# EAGLE design LSF0204RGYR (EAGLE 7.5.0)
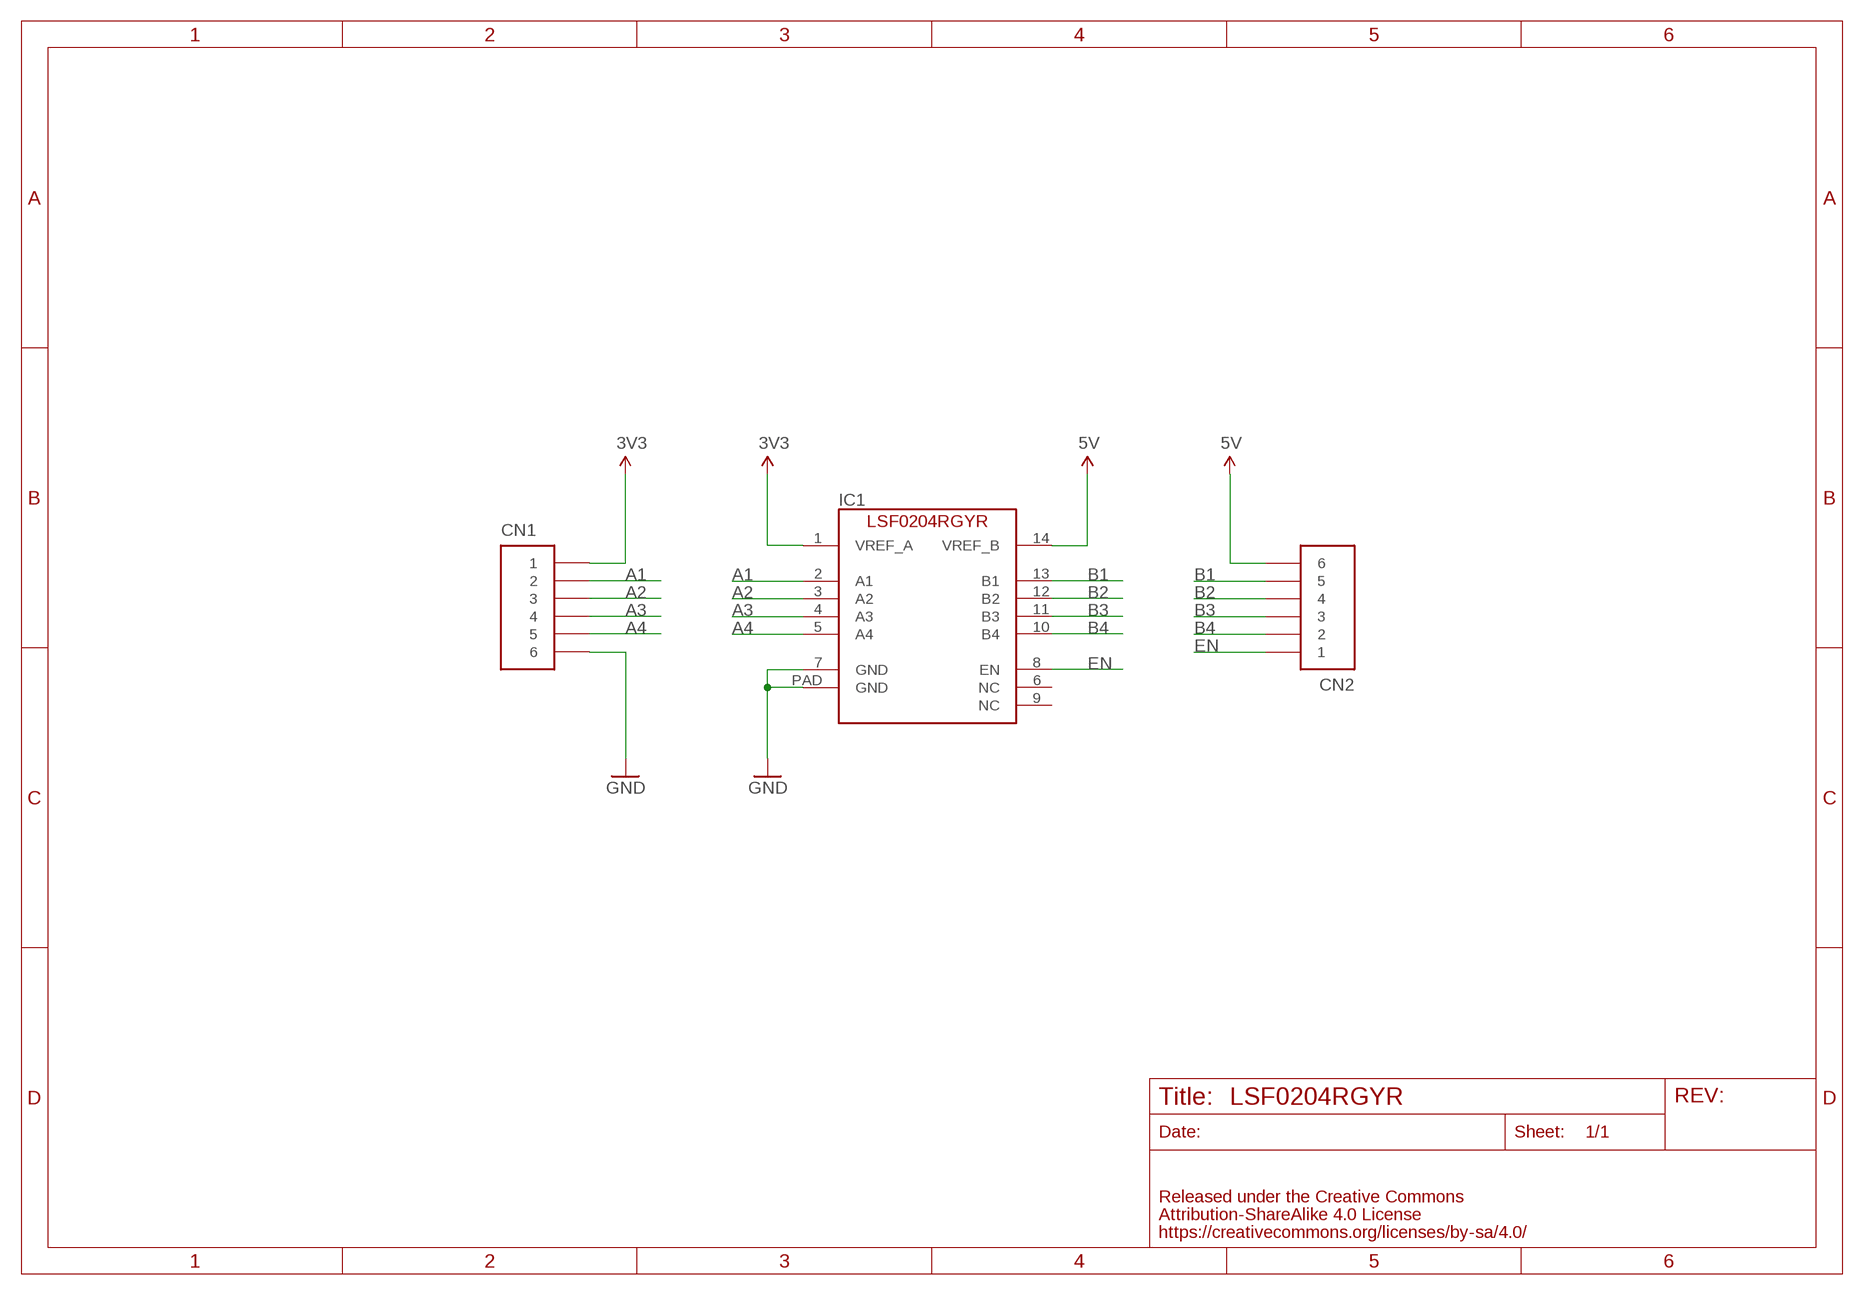
[diagram p0: schematic, sheet 1]

## Parts
CN1  PIN_HEADER_1X6-SNEAKY  [PIN_1X6_SNEAKY]
CN2  PIN_HEADER_1X6-SNEAKY  [PIN_1X6_SNEAKY]
IC1  LSF0204RGYR  [VQFN-14]

## Nets
3V3: CN1.1 IC1.1(VREF_A)
5V: CN2.6 IC1.14(VREF_B)
A1: CN1.2 IC1.2(A1)
A2: CN1.3 IC1.3(A2)
A3: CN1.4 IC1.4(A3)
A4: CN1.5 IC1.5(A4)
B1: CN2.5 IC1.13(B1)
B2: CN2.4 IC1.12(B2)
B3: CN2.3 IC1.11(B3)
B4: CN2.2 IC1.10(B4)
EN: CN2.1 IC1.8(EN)
GND: CN1.6 IC1.7(GND) IC1.PAD(GND)
Unconnected: IC1.6(NC) IC1.9(NC)

## Library data of the parts
CN1 CN2 = FaBo-PIN:PIN_HEADER_1X6
IC1 = FaBo-LevelTranslator:LSF0204RGYR

## Board
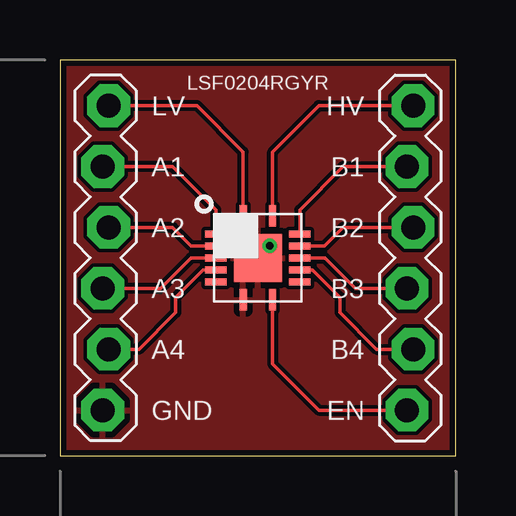
[diagram p1: board, top side]
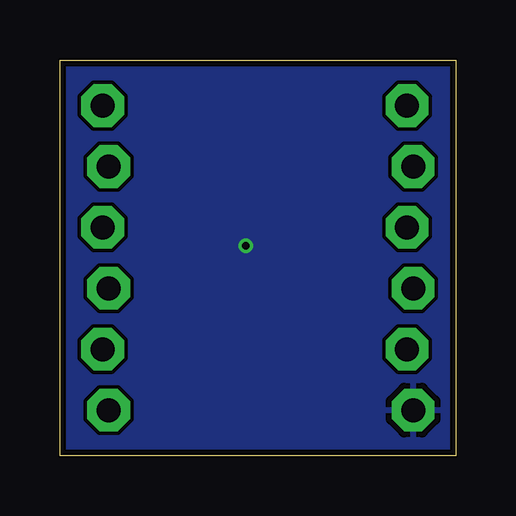
[diagram p2: board, bottom side, seen from below]

Size 16.51 x 16.51 mm. Coordinates in mm from the lower left corner, seen from the top.
Outline: 0,0 16.51,0 16.51,16.51 0,16.51 0,0
Copper layers (1*16): Top 0.035mm / dielectric 1.5mm / Bottom 0.035mm
Design rules "Elecrow_2-layer_eagle_rule": minimum track width 6mil, minimum drill 12mil, track to track 6mil, track to pad 6mil, pad to pad 6mil, via to via 6mil, smd to smd 0mil, copper to edge 10mil, drill to drill 10mil, minimum pad ring 10mil, minimum via ring 6mil, stop-mask expansion 2mil, vias tented up to drill 100mil, thermal gap 10mil

### Footprints (pad centres in the part's own frame; a part is rotated, then mirrored left to right if it is on the bottom)
PIN_1X6_SNEAKY = drill 1 pad 1.778 octagon: 1 -6.35,0.127; 2 -3.81,-0.127; 3 -1.27,0.127; 4 1.27,-0.127; 5 3.81,0.127; 6 6.35,-0.127
VQFN-14 = smd 0.9 x 0.3: 1 -1.75,-0.61; 7 1.75,-0.61; 8 1.75,0.61; 14 -1.75,0.61 | smd 0.3 x 0.9: 2 -1,-1.75; 3 -0.5,-1.75; 4 0,-1.75; 5 0.5,-1.75; 6 1,-1.75; 9 1,1.75; 10 0.5,1.75; 11 0,1.75; 12 -0.5,1.75; 13 -1,1.75 | smd 2 x 2: PAD 0,0

### Placement (x,y rotation side)
CN1  1.91,8.26 270 top
CN2  14.61,8.26 90 top
IC1  8.26,8.26 270 top

### Tracks (layer width: path | path; a pad name or v marks a point on that pad's centre or on a via)
3V3
  Top 0.152: IC1.1 7.64,12.68 5.71,14.61 CN1.1
5V
  Top 0.152: IC1.14 8.87,12.68 10.79,14.61 CN2.6
A1
  Top 0.152: IC1.2 6.5,10.26 4.7,12.06 CN1.2
A2
  Top 0.152: IC1.3 5.47,8.76 4.7,9.53 CN1.3
A3
  Top 0.152: IC1.4 5.46,8.26 4.19,6.99 CN1.4
A4
  Top 0.152: IC1.5 5.98,7.75 4.83,6.6 4.83,5.97 3.3,4.45 CN1.5
B1
  Top 0.152: IC1.13 10.01,10.26 11.81,12.06 CN2.5
B2
  Top 0.152: IC1.12 11.04,8.76 11.81,9.53 CN2.4
B3
  Top 0.152: IC1.11 11.05,8.26 12.32,6.99 CN2.3
B4
  Top 0.152: IC1.10 10.53,7.75 11.68,6.6 11.68,5.97 13.21,4.45 CN2.2
EN
  Top 0.152: IC1.8 8.87,3.83 10.79,1.91 CN2.1
GND  (via drill 0.3)
  other vias: 8.76,8.76
  pour Bottom: 0,16.51 16.51,16.51 16.51,0 0,0
  pour Top: 0,16.51 16.51,16.51 16.51,0 0,0

### Text on the board
tPlace: LSF0204RGYR | LV | HV | A1 | B1 | A2 | B2 | A3 | B3 | A4 | B4 | GND | EN